# Altium schematic sheet 0.1.SchDoc
size A4
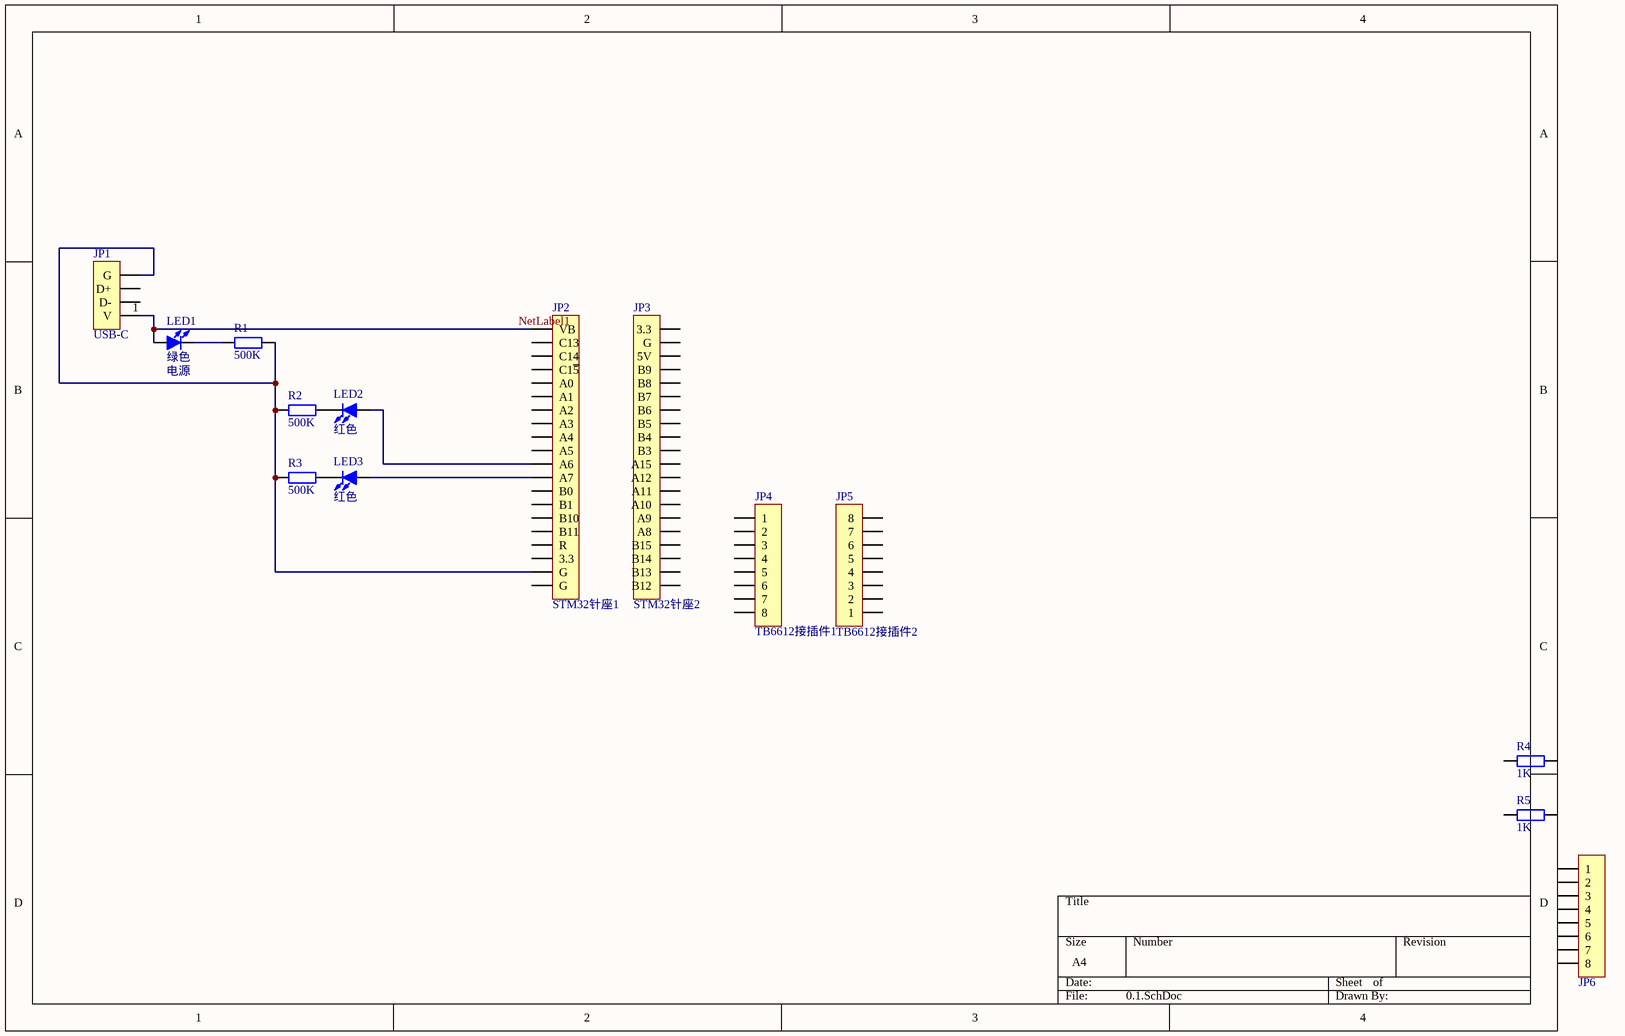
[diagram p0: 0.1.SchDoc]

## Parts
JP1  BOM名称: USB-C  [XH2.54-WI-4P]  (hidden comment: HDR-1X4)
JP2  BOM名称: STM32针座1  [HDR2.54-LI-20P]  (hidden comment: HDR-1X20)
JP3  BOM名称: STM32针座2  [HDR2.54-LI-20P]  (hidden comment: HDR-1X20)
JP4  BOM名称: TB6612接插件1  [XH2.54-WI-8P]  (hidden comment: HDR-1X8)
JP5  BOM名称: TB6612接插件2  [XH2.54-WI-8P]  (hidden comment: HDR-1X8)
JP6  HDR-1X8  [XH2.54-WI-8P]  (value not drawn)
LED1  绿色  BOM名称: 电源  [LED 0805G]
LED2  红色  [LED 0805G]
LED3  红色  [LED 0805G]
R1  500K  [R 0805_L]
R2  500K  [R 0805_L]
R3  500K  [R 0805_L]
R4  1K  [R 0805]
R5  1K  [R 0805]

## Nets
NetLabel1: JP1.1(V) JP2.1(VB) LED1.1(A)
NetJP1_4: JP1.4(G) JP2.19(G) R1.2 R2.2 R3.2
NetJP2_11: JP2.11(A6) LED2.1(A)
NetJP2_12: JP2.12(A7) LED3.1(A)
NetLED1_2: LED1.2(K) R1.1
NetLED2_2: LED2.2(K) R2.1
NetLED3_2: LED3.2(K) R3.1

Not connected (* = marked no-connect by the designer): JP1 2(D-) 3(D+); JP2 2(C13) 3(C14) 4(C1~{5}) 5(A0) 6(A1) 7(A2) 8(A3) 9(A4) 10(A5) 13(B0) 14(B1) 15(B10) 16(B11) 17(R) 18(3.3) 20(G); JP3 1(B12) 2(B13) 3(B14) 4(B15) 5(A8) 6(A9) 7(A10) 8(A11) 9(A12) 10(A15) 11(B3) 12(B4) 13(B5) 14(B6) 15(B7) 16(B8) 17(B9) 18(5V) 19(G) 20(3.3); JP4 1 2 3 4 5 6 7 8; JP5 1 2 3 4 5 6 7 8; JP6 1 2 3 4 5 6 7 8; R4 1 2; R5 1 2

## Library data of the parts
JP1 = Header 4: 4P接插件; 版权归属: 封装库来自淘宝 ID：黄晶宝石; 学习资源: https://shop463601444.taobao.com
JP2 JP3 = Header 20: 20P接插件; 版权归属: 封装库来自淘宝 ID：黄晶宝石; 学习资源: https://shop463601444.taobao.com
JP4-JP6 = Header 8: 8P接插件; 版权归属: 封装库来自淘宝 ID：黄晶宝石; 学习资源: https://shop463601444.taobao.com
  JP6: BOM名称: 8P接插件
LED1-LED3 = LED-SMD: 贴片LED; 版权归属: 源创客; 学习资源: www.ooocke.com
  LED2 LED3: BOM名称: 贴片LED
R1-R3 = R: 贴片电阻; 版权归属: 来自淘宝 ID：黄晶宝石; BOM名称: 贴片电阻; 联系售后: https://shop463601444.taobao.com
R4 R5 = R: 贴片电阻; 版权归属: 源创客; BOM名称: 贴片电阻; 学习资源: www.ooocke.com